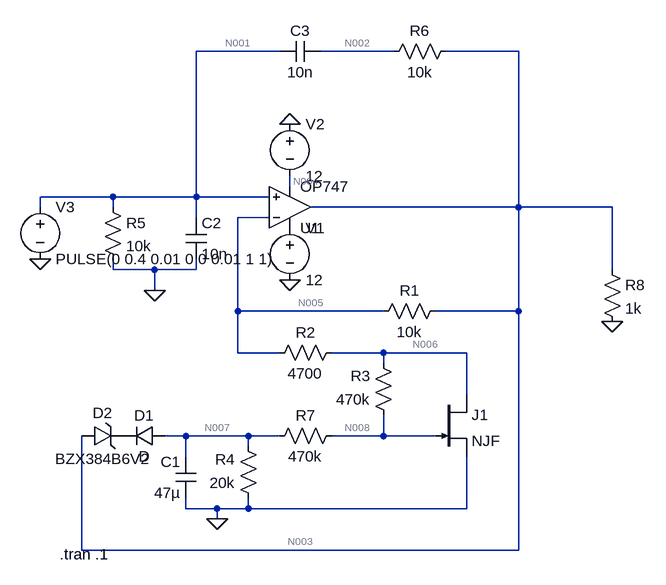
[diagram p0: schematic ej1tp5.asc]
ej1tp5.asc, the LTspice schematic file:
Version 4
SHEET 1 880 728
WIRE 160 -64 32 -64
WIRE 336 -64 224 -64
WIRE 528 -64 416 -64
WIRE 176 144 176 128
WIRE -96 160 -208 160
WIRE 32 160 32 -64
WIRE 32 160 -96 160
WIRE 144 160 32 160
WIRE -208 176 -208 160
WIRE -96 176 -96 160
WIRE 528 176 528 -64
WIRE 528 176 208 176
WIRE 672 176 528 176
WIRE 32 192 32 160
WIRE 144 192 96 192
WIRE -96 272 -96 256
WIRE -32 272 -96 272
WIRE 32 272 32 256
WIRE 32 272 -32 272
WIRE 672 272 672 176
WIRE -32 304 -32 272
WIRE 96 336 96 192
WIRE 320 336 96 336
WIRE 528 336 528 176
WIRE 528 336 400 336
WIRE 96 400 96 336
WIRE 160 400 96 400
WIRE 320 400 240 400
WIRE 448 400 320 400
WIRE 320 416 320 400
WIRE 448 464 448 400
WIRE 16 528 -16 528
WIRE 112 528 16 528
WIRE 160 528 112 528
WIRE 320 528 320 496
WIRE 320 528 240 528
WIRE 400 528 320 528
WIRE 112 544 112 528
WIRE 16 560 16 528
WIRE 16 640 16 624
WIRE 64 640 16 640
WIRE 112 640 112 624
WIRE 112 640 64 640
WIRE 448 640 448 560
WIRE 448 640 112 640
WIRE 64 656 64 640
WIRE -144 704 -144 528
WIRE 528 704 528 336
WIRE 528 704 -144 704
FLAG 176 48 0
FLAG 176 288 0
FLAG -32 304 0
FLAG 64 656 0
FLAG -208 256 0
FLAG 672 352 0
SYMBOL Opamps\\OP747 176 240 M180
SYMATTR InstName U1
SYMBOL voltage 176 192 R0
SYMATTR InstName V1
SYMATTR Value 12
SYMBOL voltage 176 32 R0
SYMATTR InstName V2
SYMATTR Value 12
SYMBOL res 416 320 R90
WINDOW 0 0 56 VBottom 2
WINDOW 3 32 56 VTop 2
SYMATTR InstName R1
SYMATTR Value 10k
SYMBOL res 256 384 R90
WINDOW 0 0 56 VBottom 2
WINDOW 3 32 56 VTop 2
SYMATTR InstName R2
SYMATTR Value 4700
SYMBOL res 336 512 R180
WINDOW 0 36 76 Left 2
WINDOW 3 36 40 Left 2
SYMATTR InstName R3
SYMATTR Value 470k
SYMBOL res 128 640 R180
WINDOW 0 36 76 Left 2
WINDOW 3 36 40 Left 2
SYMATTR InstName R4
SYMATTR Value 20k
SYMBOL cap 32 560 M0
SYMATTR InstName C1
SYMATTR Value 47µ
SYMBOL diode -16 512 R90
WINDOW 0 0 32 VBottom 2
WINDOW 3 32 32 VTop 2
SYMATTR InstName D1
SYMBOL zener -144 544 R270
WINDOW 0 36 32 VTop 2
WINDOW 3 -4 32 VBottom 2
SYMATTR InstName D2
SYMATTR Value BZX384B6V2
SYMATTR Description Diode
SYMATTR Type diode
SYMBOL res -112 160 R0
SYMATTR InstName R5
SYMATTR Value 10k
SYMBOL cap 16 192 R0
SYMATTR InstName C2
SYMATTR Value 10n
SYMBOL cap 224 -80 R90
WINDOW 0 0 32 VBottom 2
WINDOW 3 32 32 VTop 2
SYMATTR InstName C3
SYMATTR Value 10n
SYMBOL res 432 -80 R90
WINDOW 0 0 56 VBottom 2
WINDOW 3 32 56 VTop 2
SYMATTR InstName R6
SYMATTR Value 10k
SYMBOL res 256 512 R90
WINDOW 0 0 56 VBottom 2
WINDOW 3 32 56 VTop 2
SYMATTR InstName R7
SYMATTR Value 470k
SYMBOL njf 400 464 R0
SYMATTR InstName J1
SYMBOL voltage -208 160 R0
WINDOW 123 0 0 Left 0
WINDOW 39 0 0 Left 0
SYMATTR InstName V3
SYMATTR Value PULSE(0 0.4 0.01 0 0 0.01 1 1)
SYMBOL res 656 256 R0
SYMATTR InstName R8
SYMATTR Value 1k
TEXT -178 710 Left 2 !.tran .1

The netlist it stands for:
* ej1tp5.asc
XU1 N001 N005 P001 N004 N003 OP747  ; pins In+ In- V+ V- OUT
V1 P001 0 12
V2 0 N004 12
R1 N003 N005 10k
R2 N006 N005 4700
R3 N008 N006 470k
R4 0 N007 20k
C1 N007 0 47µ
D1 N007 P002 D
D2 N003 P002 BZX384B6V2
R5 N001 0 10k
C2 N001 0 10n
C3 N002 N001 10n
R6 N003 N002 10k
R7 N008 N007 470k
J1 N006 N008 0 NJF
V3 N001 0 PULSE(0 0.4 0.01 0 0 0.01 1 1)
R8 N003 0 1k
.model D D
.lib standard.dio
.model NJF NJF
.model PJF PJF
.lib standard.jft
.tran .1
.backanno
.end

* Results of the author's LTspice run, read from the files saved beside the schematic
* Operating Point, zero values left out:
*   V(n005) = 80 µV
*   V(n004) = -12 V
*   V(p001) = 12 V
*   V(n003) = 100.5 µV
*   V(n006) = 27.73 µV
*   V(n008) = 14.15 µV
*   V(n007) = 577.7 nV
*   V(p002) = 43.42 µV
*   V(n002) = 100.5 µV
*   Id(J1) = 11.09 nA
*   Is(J1) = -11.09 nA
*   I(R1) = 2.053 nA
*   I(R2) = -11.12 nA
*   I(R3) = -28.89 pA
*   I(R4) = -28.89 pA
*   I(R7) = 28.89 pA
*   I(R8) = 100.5 nA
*   I(V1) = -282.8 µA
*   I(V2) = -282.7 µA
*   I(V3) = 11.07 nA
*   Ix(u1:1) = -11.07 nA
*   Ix(u1:2) = -9.068 nA
*   Ix(u1:99) = 282.8 µA
*   Ix(u1:50) = -282.7 µA
*   Ix(u1:45) = -102.6 nA
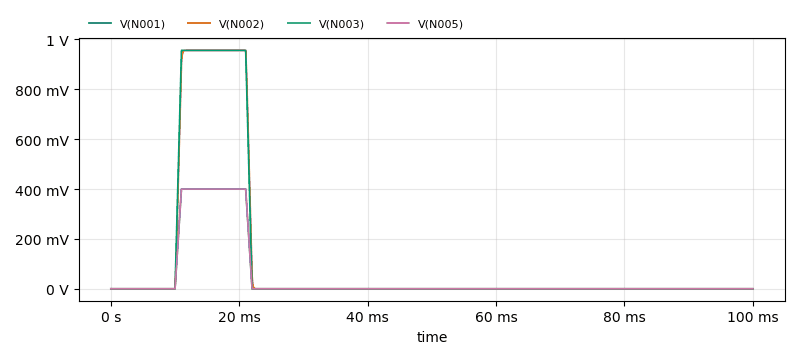
[diagram p1: Transient Analysis of ej1tp5.asc, plotted from the saved traces]
* Transient Analysis, 1 run:
*   V(N001): min 0 V, max 400 mV, average 44 mV, rms 130.7 mV, last 0 V
*   V(N002): min 99.07 µV, max 956.1 mV, average 105.3 mV, rms 312.2 mV, last 100.4 µV
*   V(N003): min 89.36 µV, max 956.2 mV, average 105.3 mV, rms 312.4 mV, last 100.4 µV
*   V(N005): min 75.38 µV, max 400.1 mV, average 44.08 mV, rms 130.7 mV, last 80 µV